# Altium schematic sheet DVT-Discrete.SchDoc
size A4
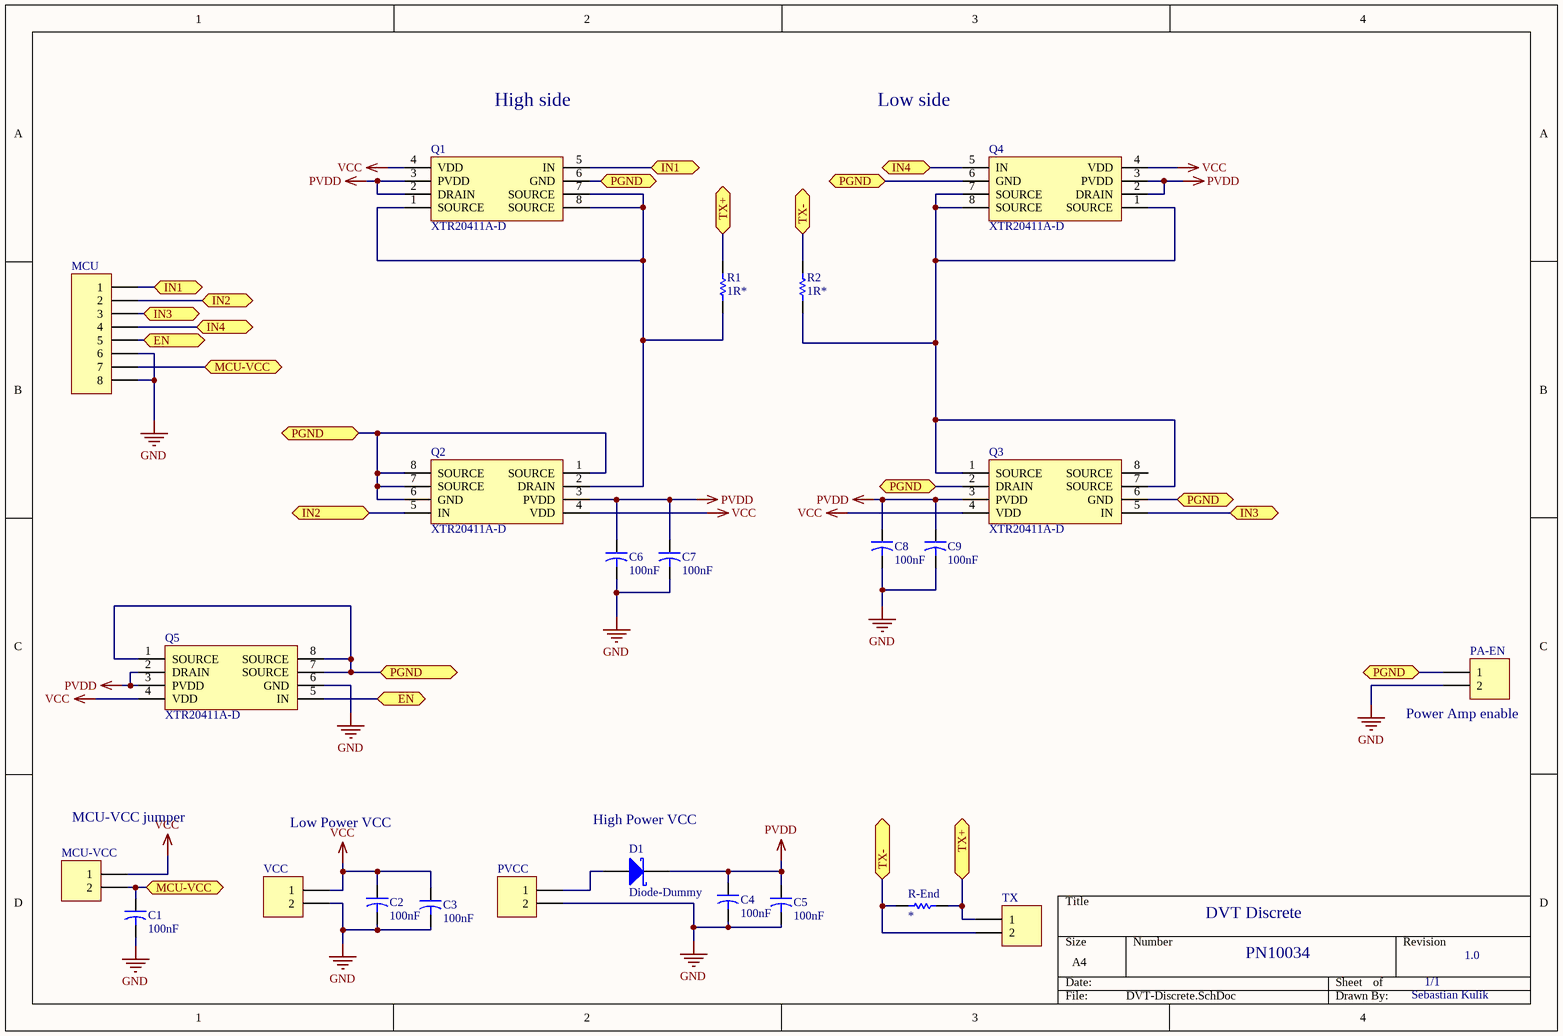
[diagram p0: DVT-Discrete.SchDoc]

## Parts
C1  value 100nF  [Dummy-10mm]  (hidden comment: Capacitor-Dummy-THT)
C2  value 100nF  [Dummy-10mm]  (hidden comment: Capacitor-Dummy-THT)
C3  value 100nF  [Dummy-10mm]  (hidden comment: Capacitor-Dummy-THT)
C4  value 100nF  [Dummy-10mm]  (hidden comment: Capacitor-Dummy-THT)
C5  value 100nF  [Dummy-10mm]  (hidden comment: Capacitor-Dummy-THT)
C6  value 100nF  [Dummy-10mm]  (hidden comment: Capacitor-Dummy-THT)
C7  value 100nF  [Dummy-10mm]  (hidden comment: Capacitor-Dummy-THT)
C8  value 100nF  [Dummy-10mm]  (hidden comment: Capacitor-Dummy-THT)
C9  value 100nF  [Dummy-10mm]  (hidden comment: Capacitor-Dummy-THT)
D1  Diode-Dummy  [DO-15-Dummy]
MCU  Plug_08_2.54  [HDR1X8_2.54]  (value not drawn)
MCU-VCC  Plug_2_90_2.54  [HDR1X2]  (value not drawn)
PA-EN  Plug_2_90_2.54  [HDR1X2]  (value not drawn)
PVCC  PHOENIX_1715721  [Phoenix-2-5_08]  (value not drawn)
Q1  XTR20411A-D  [DIP-8-Ceramic-HT]
Q2  XTR20411A-D  [DIP-8-Ceramic-HT]
Q3  XTR20411A-D  [DIP-8-Ceramic-HT]
Q4  XTR20411A-D  [DIP-8-Ceramic-HT]
Q5  XTR20411A-D  [DIP-8-Ceramic-HT]
R1  value 1R*  [Dummy-10mm]  (hidden comment: Resistor-Dummy-THT)
R2  value 1R*  [Dummy-10mm]  (hidden comment: Resistor-Dummy-THT)
R-End  Resistor-Dummy-THT  [Dummy-10mm]  (value not drawn)
TX  PHOENIX_1715721  [Phoenix-2-5_08]  (value not drawn)
VCC  PHOENIX_1715721  [Phoenix-2-5_08]  (value not drawn)

## Ports
EN, IN1, IN2, IN3, IN4, MCU-VCC, PGND, TX+, TX-

## Nets
GND: C1.2 C2.2 C3.2 C4.2 C5.2 C6.2 C7.2 C8.2 C9.2 MCU.6 MCU.8 PA-EN.2 PVCC.2 Q5.6(GND) VCC.2
PVDD: C4.1 C5.1 C6.1 C7.1 C8.1 C9.1 D1.1(K) Q1.2(DRAIN) Q1.3(PVDD) Q2.3(PVDD) Q3.3(PVDD) Q4.2(DRAIN) Q4.3(PVDD) Q5.2(DRAIN) Q5.3(PVDD)
VCC: C2.1 C3.1 MCU-VCC.1 Q1.4(VDD) Q2.4(VDD) Q3.4(VDD) Q4.4(VDD) Q5.4(VDD) VCC.1
EN: MCU.5 Q5.5(IN) ; port EN
IN1: MCU.1 Q1.5(IN) ; port IN1
IN2: MCU.2 Q2.5(IN) ; port IN2
IN3: MCU.3 Q3.5(IN) ; port IN3
IN4: MCU.4 Q4.5(IN) ; port IN4
MCU-VCC: C1.1 MCU.7 MCU-VCC.2 ; port MCU-VCC
PGND: PA-EN.1 Q1.6(GND) Q2.1(SOURCE) Q2.6(GND) Q2.7(SOURCE) Q2.8(SOURCE) Q3.2(DRAIN) Q3.6(GND) Q4.6(GND) Q5.1(SOURCE) Q5.7(SOURCE) Q5.8(SOURCE) ; port PGND
TX+: R1.2 R-End.2 TX.1 ; port TX+
TX-: R2.2 R-End.1 TX.2 ; port TX-
NetD1_2: D1.2(A) PVCC.1
NetQ1_1: Q1.1(SOURCE) Q1.7(SOURCE) Q1.8(SOURCE) Q2.2(DRAIN) R1.1
NetQ3_1: Q3.1(SOURCE) Q3.7(SOURCE) Q4.1(SOURCE) Q4.7(SOURCE) Q4.8(SOURCE) R2.1

Not connected (* = marked no-connect by the designer): Q3 8(SOURCE)

## Notes on the sheet
- High side
- Low side
- (near PA-EN) Power Amp enable
- (near MCU-VCC) MCU-VCC jumper
- Low Power VCC
- (near D1) High Power VCC
- DVT Discrete
- PN10034
- 1/1
- 1.0
- Sebastian Kulik

## Library data of the parts
MCU = Plug_08_2.54: Plug, 08-Pin; Manufacturer PartNr: 61300811121; Manufacturer: WE; TDE-PN: CON0035; LatestRevisionDate: 11.11.2014; LatestRevisionNote: Re-released for DXP Platform.; Publisher: Sebastian Kulik; Deliverer: WE; Deliverer PartNr: 61300811121
MCU-VCC PA-EN = Plug_2_90_2.54: Plug, 2-Pin; Manufacturer PartNr: 61300211021; Manufacturer: WE; Deliverer PartNr: 2356176; Deliverer: Farnell; TDE-PN: CON0010; LatestRevisionDate: 14.05.2014; LatestRevisionNote: Re-released for DXP Platform.; Publisher: Sebastian Kulik
PVCC TX VCC = 2Pol_1715721: Phoenix, 2 pol, 5.08mm, 22A, 715721; Deliverer PartNr: 3041529; Deliverer: Farnell; TDE-PN: CON0008; LatestRevisionDate: 02.05.2014; LatestRevisionNote: Re-released for DXP Platform.; Publisher: Sebastian Kulik; Manufacturer PartNr: 1715721; Manufacturer: Phoenix; PackageDescription: Phoenix-2-5_08
Q1-Q5 = XTR20411A-D: Gate driver; Manufacturer: X-Rel; TDE-PN: IC0068; Deliverer: ProTec; Published: 08.12.2015; Publisher: Sebastian Kulik; PackageDescription: DIP-8-Ceramic-HT; Manufacturer PartNr: XTR20411A-D; Deliverer PartNr: XTR20411A-D
C1-C9 = Capacitor-Dummy-THT: Published: 08.12.2015; Part Description: Capacitor-Dummy-THT; Publisher: Sebastian Kulik; PackageDescription: -; Deliverer: -; Deliverer PartNr: -; Manufacturer: -; Manufacturer PartNr: -; TDE-PN: -
D1 = Diode-Dummy: Published: 09.12.2015; TDE-PN: -; Publisher: Sebastian Kulik; PackageDescription: -; Manufacturer PartNr: -; Deliverer: -; Deliverer PartNr: -; Manufacturer: -
R1 R2 R-End = Resistor-Dummy-THT: Published: 08.12.2015; Publisher: Sebastian Kulik; PackageDescription: -; Manufacturer: -; Manufacturer PartNr: -; TDE-PN: -; Deliverer PartNr: -; Deliverer: -; Part Desicription: Resistor-Dummy-THT
  R-End: Value: *